# EAGLE schematic 5_cpu_registers_a (EAGLE 6.6.0)

## Sheet 1 of 2
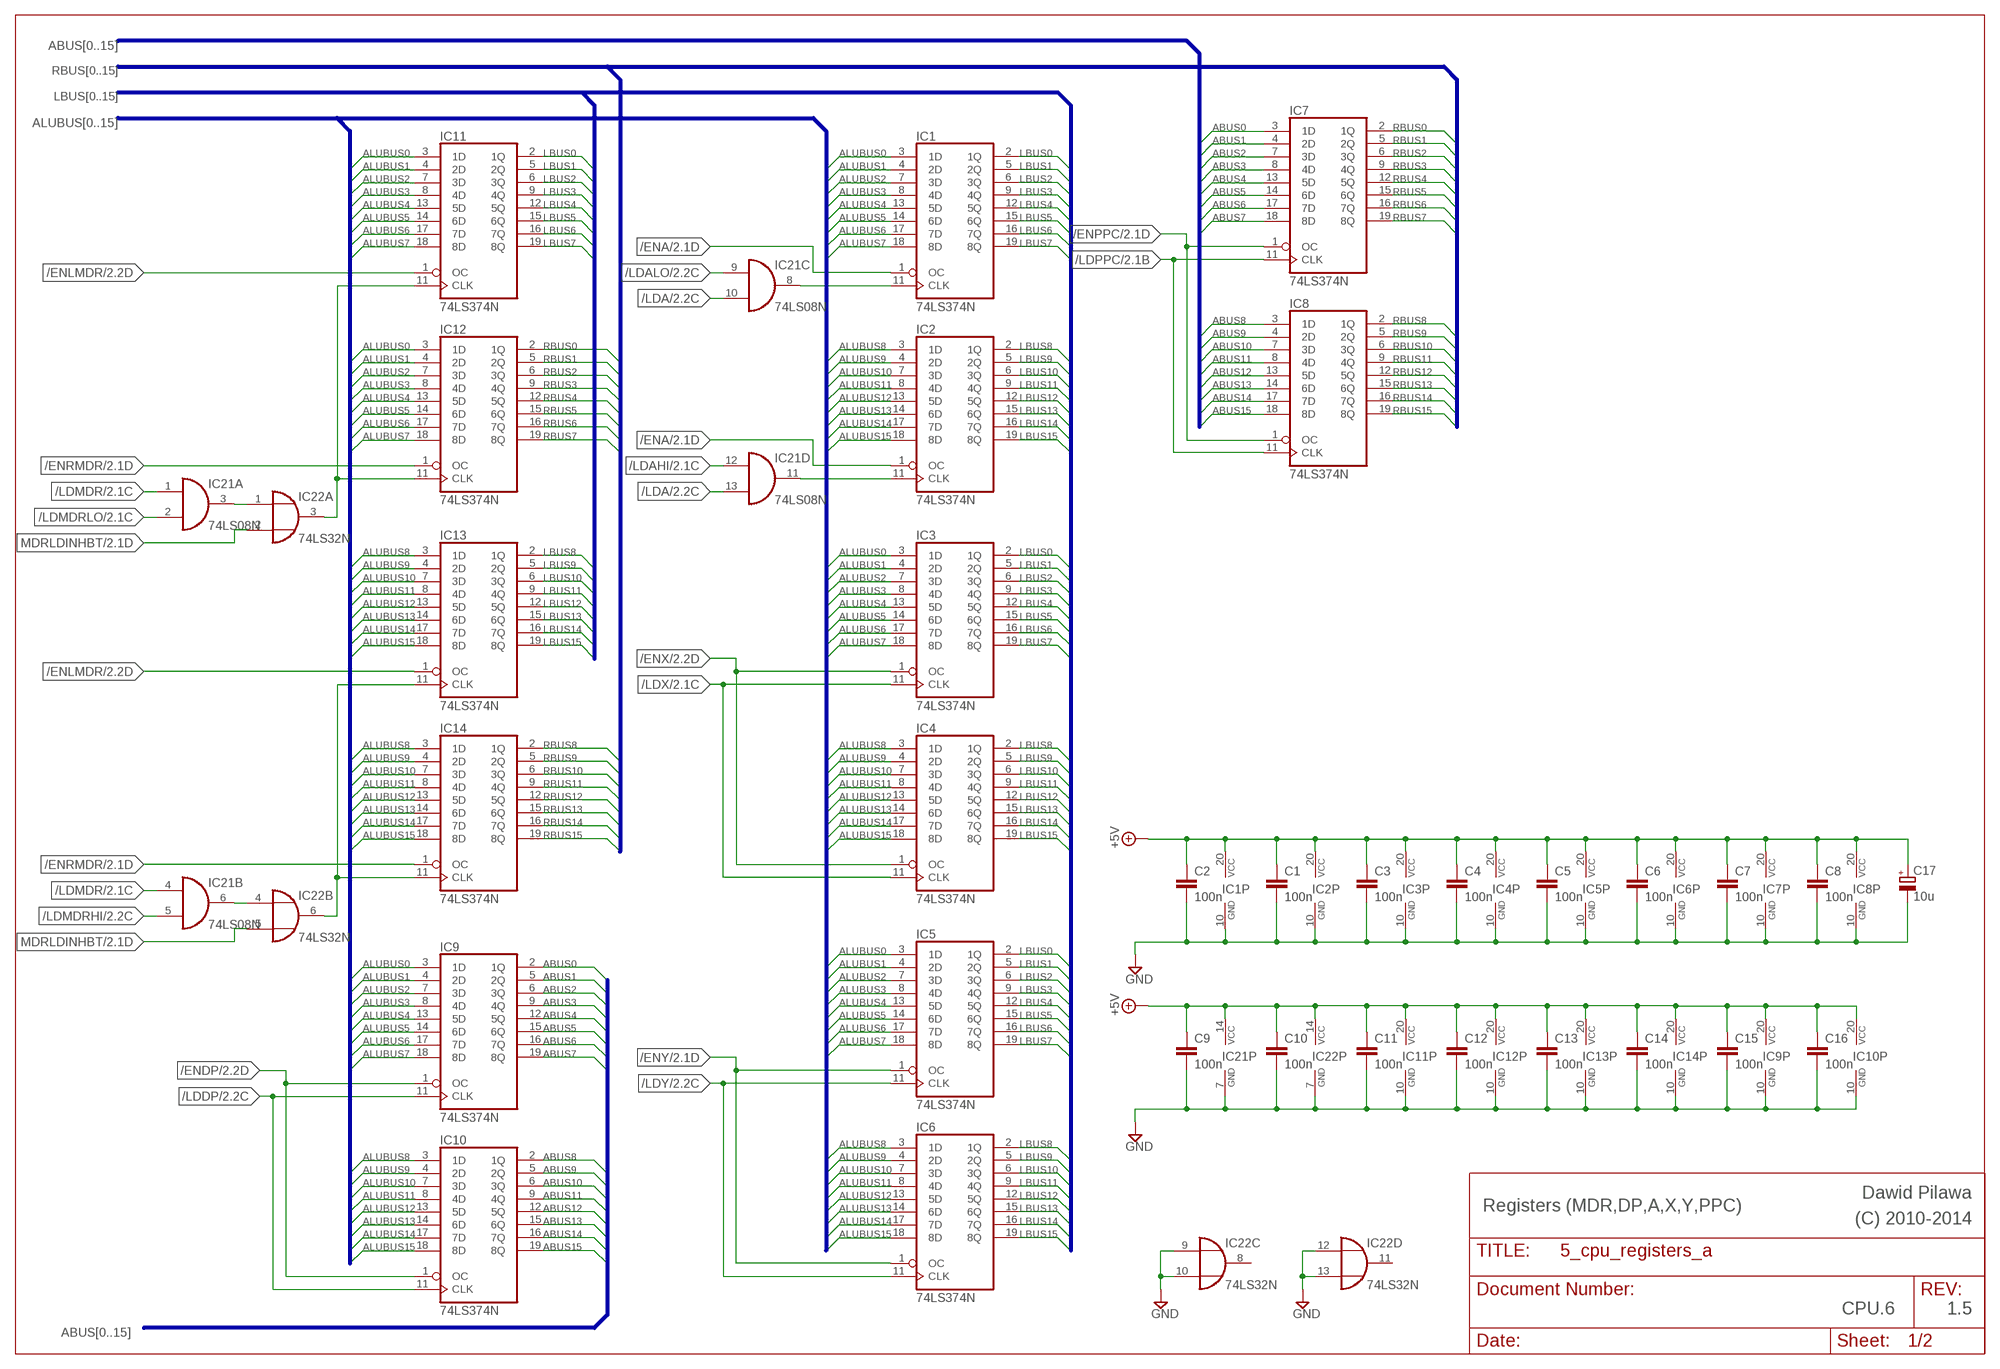
[diagram p0: schematic, sheet 1]

### Parts
C1  100n  C-EU050-024X044  [C050-024X044]
C2  100n  C-EU050-024X044  [C050-024X044]
C3  100n  C-EU050-024X044  [C050-024X044]
C4  100n  C-EU050-024X044  [C050-024X044]
C5  100n  C-EU050-024X044  [C050-024X044]
C6  100n  C-EU050-024X044  [C050-024X044]
C7  100n  C-EU050-024X044  [C050-024X044]
C8  100n  C-EU050-024X044  [C050-024X044]
C9  100n  C-EU050-024X044  [C050-024X044]
C10  100n  C-EU050-024X044  [C050-024X044]
C11  100n  C-EU050-024X044  [C050-024X044]
C12  100n  C-EU050-024X044  [C050-024X044]
C13  100n  C-EU050-024X044  [C050-024X044]
C14  100n  C-EU050-024X044  [C050-024X044]
C15  100n  C-EU050-024X044  [C050-024X044]
C16  100n  C-EU050-024X044  [C050-024X044]
C17  10u  CPOL-EUE2.5-6  [E2,5-6]
IC1  74LS374N  [DIL20]
IC2  74LS374N  [DIL20]
IC3  74LS374N  [DIL20]
IC4  74LS374N  [DIL20]
IC5  74LS374N  [DIL20]
IC6  74LS374N  [DIL20]
IC7  74LS374N  [DIL20]
IC8  74LS374N  [DIL20]
IC9  74LS374N  [DIL20]
IC10  74LS374N  [DIL20]
IC11  74LS374N  [DIL20]
IC12  74LS374N  [DIL20]
IC13  74LS374N  [DIL20]
IC14  74LS374N  [DIL20]
IC21  74LS08N  [DIL14]
IC22  74LS32N  [DIL14]

### Nets
+5V: C1.1 C2.1 C3.1 C4.1 C5.1 C6.1 C7.1 C8.1 C9.1 C10.1 C11.1 C12.1 C13.1 C14.1 C15.1 C16.1 C17.+ IC1.20(VCC) IC2.20(VCC) IC3.20(VCC) IC4.20(VCC) IC5.20(VCC) IC6.20(VCC) IC7.20(VCC) IC8.20(VCC) IC9.20(VCC) IC10.20(VCC) IC11.20(VCC) IC12.20(VCC) IC13.20(VCC) IC14.20(VCC) IC21.14(P:VCC) IC22.14(P:VCC) ; also sheet 2
/ENA: IC1.1(OC) IC2.1(OC) ; also sheet 2
/ENDP: IC9.1(OC) IC10.1(OC) ; also sheet 2
/ENLMDR: IC11.1(OC) IC13.1(OC) ; also sheet 2
/ENPPC: IC7.1(OC) IC8.1(OC) ; also sheet 2
/ENRMDR: IC12.1(OC) IC14.1(OC) ; also sheet 2
/ENX: IC3.1(OC) IC4.1(OC) ; also sheet 2
/ENY: IC5.1(OC) IC6.1(OC) ; also sheet 2
/LDA: IC21.10(C:I1) IC21.13(D:I1) ; also sheet 2
/LDAHI: IC21.12(D:I0) ; also sheet 2
/LDALO: IC21.9(C:I0) ; also sheet 2
/LDDP: IC9.11(CLK) IC10.11(CLK) ; also sheet 2
/LDMDR: IC21.1(A:I0) IC21.4(B:I0) ; also sheet 2
/LDMDRHI: IC21.5(B:I1) ; also sheet 2
/LDMDRLO: IC21.2(A:I1) ; also sheet 2
/LDPPC: IC7.11(CLK) IC8.11(CLK) ; also sheet 2
/LDX: IC3.11(CLK) IC4.11(CLK) ; also sheet 2
/LDY: IC5.11(CLK) IC6.11(CLK) ; also sheet 2
ABUS0: IC7.3(1D) IC9.2(1Q) ; also sheet 2
ABUS1: IC7.4(2D) IC9.5(2Q) ; also sheet 2
ABUS2: IC7.7(3D) IC9.6(3Q) ; also sheet 2
ABUS3: IC7.8(4D) IC9.9(4Q) ; also sheet 2
ABUS4: IC7.13(5D) IC9.12(5Q) ; also sheet 2
ABUS5: IC7.14(6D) IC9.15(6Q) ; also sheet 2
ABUS6: IC7.17(7D) IC9.16(7Q) ; also sheet 2
ABUS7: IC7.18(8D) IC9.19(8Q) ; also sheet 2
ABUS8: IC8.3(1D) IC10.2(1Q) ; also sheet 2
ABUS9: IC8.4(2D) IC10.5(2Q) ; also sheet 2
ABUS10: IC8.7(3D) IC10.6(3Q) ; also sheet 2
ABUS11: IC8.8(4D) IC10.9(4Q) ; also sheet 2
ABUS12: IC8.13(5D) IC10.12(5Q) ; also sheet 2
ABUS13: IC8.14(6D) IC10.15(6Q) ; also sheet 2
ABUS14: IC8.17(7D) IC10.16(7Q) ; also sheet 2
ABUS15: IC8.18(8D) IC10.19(8Q) ; also sheet 2
ALUBUS0: IC1.3(1D) IC3.3(1D) IC5.3(1D) IC9.3(1D) IC11.3(1D) IC12.3(1D) ; also sheet 2
ALUBUS1: IC1.4(2D) IC3.4(2D) IC5.4(2D) IC9.4(2D) IC11.4(2D) IC12.4(2D) ; also sheet 2
ALUBUS2: IC1.7(3D) IC3.7(3D) IC5.7(3D) IC9.7(3D) IC11.7(3D) IC12.7(3D) ; also sheet 2
ALUBUS3: IC1.8(4D) IC3.8(4D) IC5.8(4D) IC9.8(4D) IC11.8(4D) IC12.8(4D) ; also sheet 2
ALUBUS4: IC1.13(5D) IC3.13(5D) IC5.13(5D) IC9.13(5D) IC11.13(5D) IC12.13(5D) ; also sheet 2
ALUBUS5: IC1.14(6D) IC3.14(6D) IC5.14(6D) IC9.14(6D) IC11.14(6D) IC12.14(6D) ; also sheet 2
ALUBUS6: IC1.17(7D) IC3.17(7D) IC5.17(7D) IC9.17(7D) IC11.17(7D) IC12.17(7D) ; also sheet 2
ALUBUS7: IC1.18(8D) IC3.18(8D) IC5.18(8D) IC9.18(8D) IC11.18(8D) IC12.18(8D) ; also sheet 2
ALUBUS8: IC2.3(1D) IC4.3(1D) IC6.3(1D) IC10.3(1D) IC13.3(1D) IC14.3(1D) ; also sheet 2
ALUBUS9: IC2.4(2D) IC4.4(2D) IC6.4(2D) IC10.4(2D) IC13.4(2D) IC14.4(2D) ; also sheet 2
ALUBUS10: IC2.7(3D) IC4.7(3D) IC6.7(3D) IC10.7(3D) IC13.7(3D) IC14.7(3D) ; also sheet 2
ALUBUS11: IC2.8(4D) IC4.8(4D) IC6.8(4D) IC10.8(4D) IC13.8(4D) IC14.8(4D) ; also sheet 2
ALUBUS12: IC2.13(5D) IC4.13(5D) IC6.13(5D) IC10.13(5D) IC13.13(5D) IC14.13(5D) ; also sheet 2
ALUBUS13: IC2.14(6D) IC4.14(6D) IC6.14(6D) IC10.14(6D) IC13.14(6D) IC14.14(6D) ; also sheet 2
ALUBUS14: IC2.17(7D) IC4.17(7D) IC6.17(7D) IC10.17(7D) IC13.17(7D) IC14.17(7D) ; also sheet 2
ALUBUS15: IC2.18(8D) IC4.18(8D) IC6.18(8D) IC10.18(8D) IC13.18(8D) IC14.18(8D) ; also sheet 2
GND: C1.2 C2.2 C3.2 C4.2 C5.2 C6.2 C7.2 C8.2 C9.2 C10.2 C11.2 C12.2 C13.2 C14.2 C15.2 C16.2 C17.- IC1.10(GND) IC2.10(GND) IC3.10(GND) IC4.10(GND) IC5.10(GND) IC6.10(GND) IC7.10(GND) IC8.10(GND) IC9.10(GND) IC10.10(GND) IC11.10(GND) IC12.10(GND) IC13.10(GND) IC14.10(GND) IC21.7(P:GND) IC22.7(P:GND) IC22.9(C:I0) IC22.10(C:I1) IC22.12(D:I0) IC22.13(D:I1) ; also sheet 2
LBUS0: IC1.2(1Q) IC3.2(1Q) IC5.2(1Q) IC11.2(1Q) ; also sheet 2
LBUS1: IC1.5(2Q) IC3.5(2Q) IC5.5(2Q) IC11.5(2Q) ; also sheet 2
LBUS2: IC1.6(3Q) IC3.6(3Q) IC5.6(3Q) IC11.6(3Q) ; also sheet 2
LBUS3: IC1.9(4Q) IC3.9(4Q) IC5.9(4Q) IC11.9(4Q) ; also sheet 2
LBUS4: IC1.12(5Q) IC3.12(5Q) IC5.12(5Q) IC11.12(5Q) ; also sheet 2
LBUS5: IC1.15(6Q) IC3.15(6Q) IC5.15(6Q) IC11.15(6Q) ; also sheet 2
LBUS6: IC1.16(7Q) IC3.16(7Q) IC5.16(7Q) IC11.16(7Q) ; also sheet 2
LBUS7: IC1.19(8Q) IC3.19(8Q) IC5.19(8Q) IC11.19(8Q) ; also sheet 2
LBUS8: IC2.2(1Q) IC4.2(1Q) IC6.2(1Q) IC13.2(1Q) ; also sheet 2
LBUS9: IC2.5(2Q) IC4.5(2Q) IC6.5(2Q) IC13.5(2Q) ; also sheet 2
LBUS10: IC2.6(3Q) IC4.6(3Q) IC6.6(3Q) IC13.6(3Q) ; also sheet 2
LBUS11: IC2.9(4Q) IC4.9(4Q) IC6.9(4Q) IC13.9(4Q) ; also sheet 2
LBUS12: IC2.12(5Q) IC4.12(5Q) IC6.12(5Q) IC13.12(5Q) ; also sheet 2
LBUS13: IC2.15(6Q) IC4.15(6Q) IC6.15(6Q) IC13.15(6Q) ; also sheet 2
LBUS14: IC2.16(7Q) IC4.16(7Q) IC6.16(7Q) IC13.16(7Q) ; also sheet 2
LBUS15: IC2.19(8Q) IC4.19(8Q) IC6.19(8Q) IC13.19(8Q) ; also sheet 2
MDRLDINHBT: IC22.2(A:I1) IC22.5(B:I1) ; also sheet 2
N$1: IC11.11(CLK) IC12.11(CLK) IC22.3(A:O)
N$3: IC21.3(A:O) IC22.1(A:I0)
N$4: IC21.6(B:O) IC22.4(B:I0)
N$5: IC13.11(CLK) IC14.11(CLK) IC22.6(B:O)
N$21: IC1.11(CLK) IC21.8(C:O)
N$22: IC2.11(CLK) IC21.11(D:O)
RBUS0: IC7.2(1Q) IC12.2(1Q) ; also sheet 2
RBUS1: IC7.5(2Q) IC12.5(2Q) ; also sheet 2
RBUS2: IC7.6(3Q) IC12.6(3Q) ; also sheet 2
RBUS3: IC7.9(4Q) IC12.9(4Q) ; also sheet 2
RBUS4: IC7.12(5Q) IC12.12(5Q) ; also sheet 2
RBUS5: IC7.15(6Q) IC12.15(6Q) ; also sheet 2
RBUS6: IC7.16(7Q) IC12.16(7Q) ; also sheet 2
RBUS7: IC7.19(8Q) IC12.19(8Q) ; also sheet 2
RBUS8: IC8.2(1Q) IC14.2(1Q) ; also sheet 2
RBUS9: IC8.5(2Q) IC14.5(2Q) ; also sheet 2
RBUS10: IC8.6(3Q) IC14.6(3Q) ; also sheet 2
RBUS11: IC8.9(4Q) IC14.9(4Q) ; also sheet 2
RBUS12: IC8.12(5Q) IC14.12(5Q) ; also sheet 2
RBUS13: IC8.15(6Q) IC14.15(6Q) ; also sheet 2
RBUS14: IC8.16(7Q) IC14.16(7Q) ; also sheet 2
RBUS15: IC8.19(8Q) IC14.19(8Q) ; also sheet 2
Unconnected: IC22.8(C:O) IC22.11(D:O)

### Buses
ALUBUS[0..15]
LBUS[0..15]
RBUS[0..15]
ABUS[0..15]

### Notes on the sheet
- Dawid Pilawa
- Registers (MDR,DP,A,X,Y,PPC) | (C) 2010-2014
- CPU.6 | 1.5

## Sheet 2 of 2
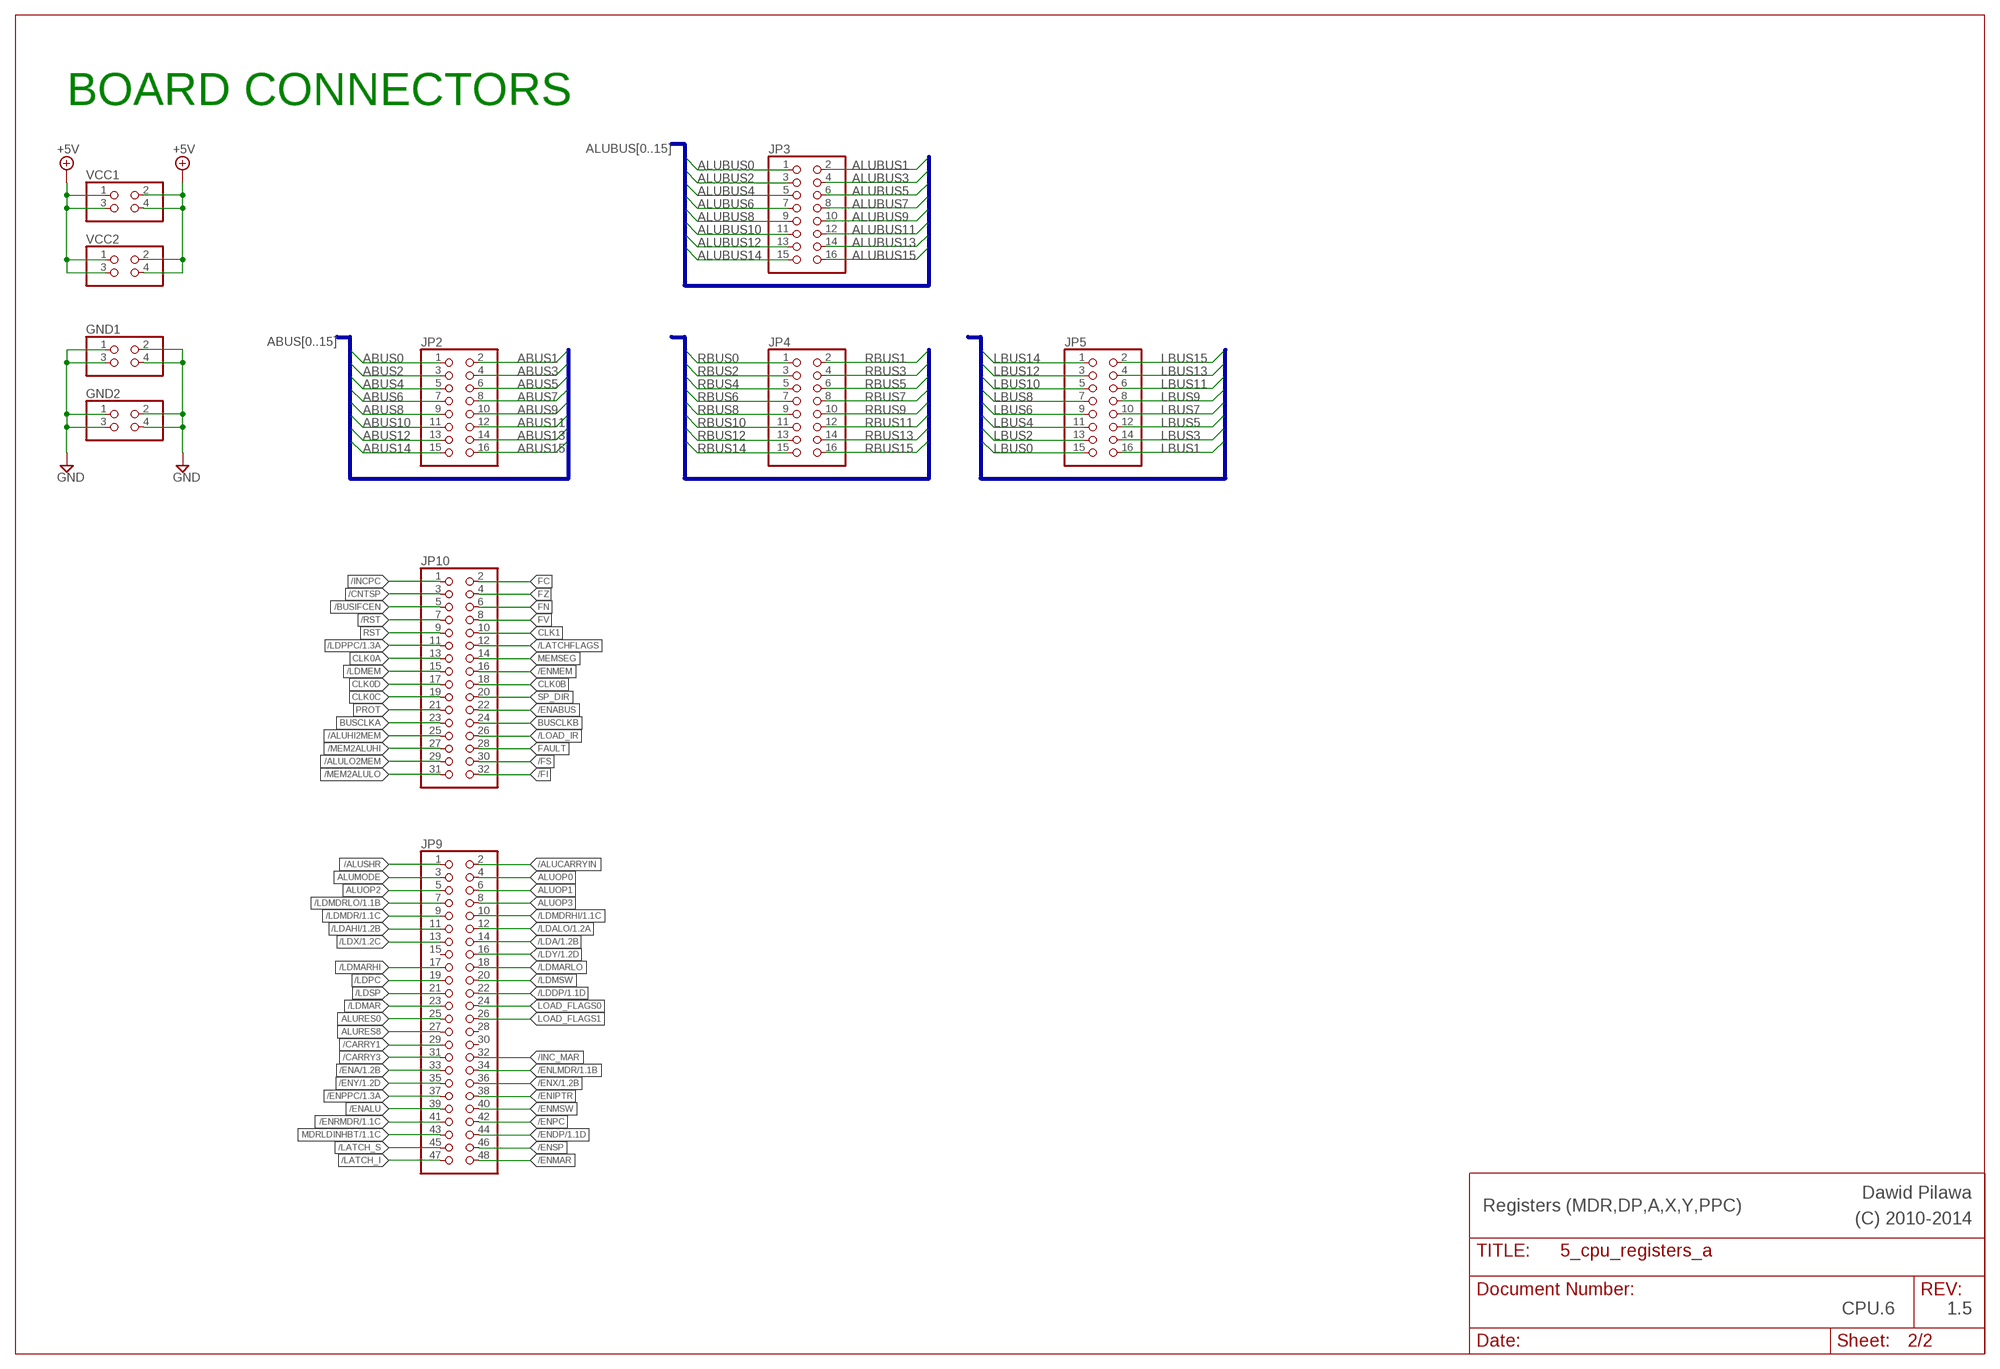
[diagram p1: schematic, sheet 2]

### Parts
GND1  PINHD-2X2  [2X02]
GND2  PINHD-2X2  [2X02]
JP2  PINHD-2X8  [2X08]
JP3  PINHD-2X8  [2X08]
JP4  PINHD-2X8  [2X08]
JP5  PINHD-2X8  [2X08]
JP9  PINHD-2X24  [2X24]
JP10  PINHD-2X16  [2X16]
VCC1  PINHD-2X2  [2X02]
VCC2  PINHD-2X2  [2X02]

### Nets
+5V: VCC1.1 VCC1.2 VCC1.3 VCC1.4 VCC2.1 VCC2.2 VCC2.3 VCC2.4 ; also sheet 1
/ALUCARRYIN: JP9.2
/ALUHI2MEM: JP10.25
/ALULO2MEM: JP10.29
/ALUSHR: JP9.1
/BUSIFCEN: JP10.5
/CARRY1: JP9.29
/CARRY3: JP9.31
/CNTSP: JP10.3
/ENA: JP9.33 ; also sheet 1
/ENABUS: JP10.22
/ENALU: JP9.39
/ENDP: JP9.44 ; also sheet 1
/ENIPTR: JP9.38
/ENLMDR: JP9.34 ; also sheet 1
/ENMAR: JP9.48
/ENMEM: JP10.16
/ENMSW: JP9.40
/ENPC: JP9.42
/ENPPC: JP9.37 ; also sheet 1
/ENRMDR: JP9.41 ; also sheet 1
/ENSP: JP9.46
/ENX: JP9.36 ; also sheet 1
/ENY: JP9.35 ; also sheet 1
/FI: JP10.32
/FS: JP10.30
/INC_MAR: JP9.32
/INCPC: JP10.1
/LATCH_I: JP9.47
/LATCH_S: JP9.45
/LATCHFLAGS: JP10.12
/LDA: JP9.14 ; also sheet 1
/LDAHI: JP9.11 ; also sheet 1
/LDALO: JP9.12 ; also sheet 1
/LDDP: JP9.22 ; also sheet 1
/LDMAR: JP9.23
/LDMARHI: JP9.17
/LDMARLO: JP9.18
/LDMDR: JP9.9 ; also sheet 1
/LDMDRHI: JP9.10 ; also sheet 1
/LDMDRLO: JP9.7 ; also sheet 1
/LDMEM: JP10.15
/LDMSW: JP9.20
/LDPC: JP9.19
/LDPPC: JP10.11 ; also sheet 1
/LDSP: JP9.21
/LDX: JP9.13 ; also sheet 1
/LDY: JP9.16 ; also sheet 1
/LOAD_IR: JP10.26
/MEM2ALUHI: JP10.27
/MEM2ALULO: JP10.31
/RST: JP10.7
ABUS0: JP2.1 ; also sheet 1
ABUS1: JP2.2 ; also sheet 1
ABUS2: JP2.3 ; also sheet 1
ABUS3: JP2.4 ; also sheet 1
ABUS4: JP2.5 ; also sheet 1
ABUS5: JP2.6 ; also sheet 1
ABUS6: JP2.7 ; also sheet 1
ABUS7: JP2.8 ; also sheet 1
ABUS8: JP2.9 ; also sheet 1
ABUS9: JP2.10 ; also sheet 1
ABUS10: JP2.11 ; also sheet 1
ABUS11: JP2.12 ; also sheet 1
ABUS12: JP2.13 ; also sheet 1
ABUS13: JP2.14 ; also sheet 1
ABUS14: JP2.15 ; also sheet 1
ABUS15: JP2.16 ; also sheet 1
ALUBUS0: JP3.1 ; also sheet 1
ALUBUS1: JP3.2 ; also sheet 1
ALUBUS2: JP3.3 ; also sheet 1
ALUBUS3: JP3.4 ; also sheet 1
ALUBUS4: JP3.5 ; also sheet 1
ALUBUS5: JP3.6 ; also sheet 1
ALUBUS6: JP3.7 ; also sheet 1
ALUBUS7: JP3.8 ; also sheet 1
ALUBUS8: JP3.9 ; also sheet 1
ALUBUS9: JP3.10 ; also sheet 1
ALUBUS10: JP3.11 ; also sheet 1
ALUBUS11: JP3.12 ; also sheet 1
ALUBUS12: JP3.13 ; also sheet 1
ALUBUS13: JP3.14 ; also sheet 1
ALUBUS14: JP3.15 ; also sheet 1
ALUBUS15: JP3.16 ; also sheet 1
ALUMODE: JP9.3
ALUOP0: JP9.4
ALUOP1: JP9.6
ALUOP2: JP9.5
ALUOP3: JP9.8
ALURES0: JP9.25
ALURES8: JP9.27
BUSCLKA: JP10.23
BUSCLKB: JP10.24
CLK0A: JP10.13
CLK0B: JP10.18
CLK0C: JP10.19
CLK0D: JP10.17
CLK1: JP10.10
FAULT: JP10.28
FC: JP10.2
FN: JP10.6
FV: JP10.8
FZ: JP10.4
GND: GND1.1 GND1.2 GND1.3 GND1.4 GND2.1 GND2.2 GND2.3 GND2.4 ; also sheet 1
LBUS0: JP5.15 ; also sheet 1
LBUS1: JP5.16 ; also sheet 1
LBUS2: JP5.13 ; also sheet 1
LBUS3: JP5.14 ; also sheet 1
LBUS4: JP5.11 ; also sheet 1
LBUS5: JP5.12 ; also sheet 1
LBUS6: JP5.9 ; also sheet 1
LBUS7: JP5.10 ; also sheet 1
LBUS8: JP5.7 ; also sheet 1
LBUS9: JP5.8 ; also sheet 1
LBUS10: JP5.5 ; also sheet 1
LBUS11: JP5.6 ; also sheet 1
LBUS12: JP5.3 ; also sheet 1
LBUS13: JP5.4 ; also sheet 1
LBUS14: JP5.1 ; also sheet 1
LBUS15: JP5.2 ; also sheet 1
LOAD_FLAGS0: JP9.24
LOAD_FLAGS1: JP9.26
MDRLDINHBT: JP9.43 ; also sheet 1
MEMSEG: JP10.14
PROT: JP10.21
RBUS0: JP4.1 ; also sheet 1
RBUS1: JP4.2 ; also sheet 1
RBUS2: JP4.3 ; also sheet 1
RBUS3: JP4.4 ; also sheet 1
RBUS4: JP4.5 ; also sheet 1
RBUS5: JP4.6 ; also sheet 1
RBUS6: JP4.7 ; also sheet 1
RBUS7: JP4.8 ; also sheet 1
RBUS8: JP4.9 ; also sheet 1
RBUS9: JP4.10 ; also sheet 1
RBUS10: JP4.11 ; also sheet 1
RBUS11: JP4.12 ; also sheet 1
RBUS12: JP4.13 ; also sheet 1
RBUS13: JP4.14 ; also sheet 1
RBUS14: JP4.15 ; also sheet 1
RBUS15: JP4.16 ; also sheet 1
RST: JP10.9
SP_DIR: JP10.20
Unconnected: JP9.15 JP9.28 JP9.30

### Buses
ALUBUS[0..15]
LBUS[0..15]
RBUS[0..15]
ABUS[0..15]

### Notes on the sheet
- BOARD CONNECTORS
- Dawid Pilawa
- Registers (MDR,DP,A,X,Y,PPC) | (C) 2010-2014
- CPU.6 | 1.5

## Library data of the parts
C1-C16 = rcl:C-EU: CAPACITOR, European symbol
C17 = rcl:CPOL-EU: POLARIZED CAPACITOR, European symbol
GND1 GND2 VCC1 VCC2 = pinhead:PINHD-2X2: PIN HEADER
IC1-IC14 = 74xx-eu:74*374: Octal D type transparent LATCH, edge triggered
IC21 = 74xx-eu:74*08: Quad 2-input AND gate
IC22 = 74xx-eu:74*32: Quad 2-input OR gate
JP2-JP5 = pinhead:PINHD-2X8: PIN HEADER
JP9 = pinhead:PINHD-2X24: PIN HEADER
JP10 = pinhead:PINHD-2X16: PIN HEADER